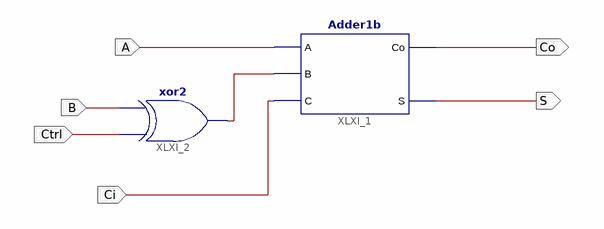
[diagram p0: schematic sheet 1]
// Xilinx ISE schematic AddSub1b.sch (kintex7) as structural Verilog: 2 symbols, 6 ports
module AddSub1b (
  input  A,
  input  B,
  input  Ctrl,
  input  Ci,
  output Co,
  output S
);

  wire XLXN_4;

  Adder1b XLXI_1 (.A(A), .B(XLXN_4), .C(Ci), .Co(Co), .S(S));
  xor XLXI_2 (XLXN_4, Ctrl, B);
endmodule
